# Altium project AMA4PEVB.PrjPcb (part 2 of 2)

## Sheet P06_GPIO Headers.SchDoc
size C; SheetNumber: 3; SheetTotal: 3
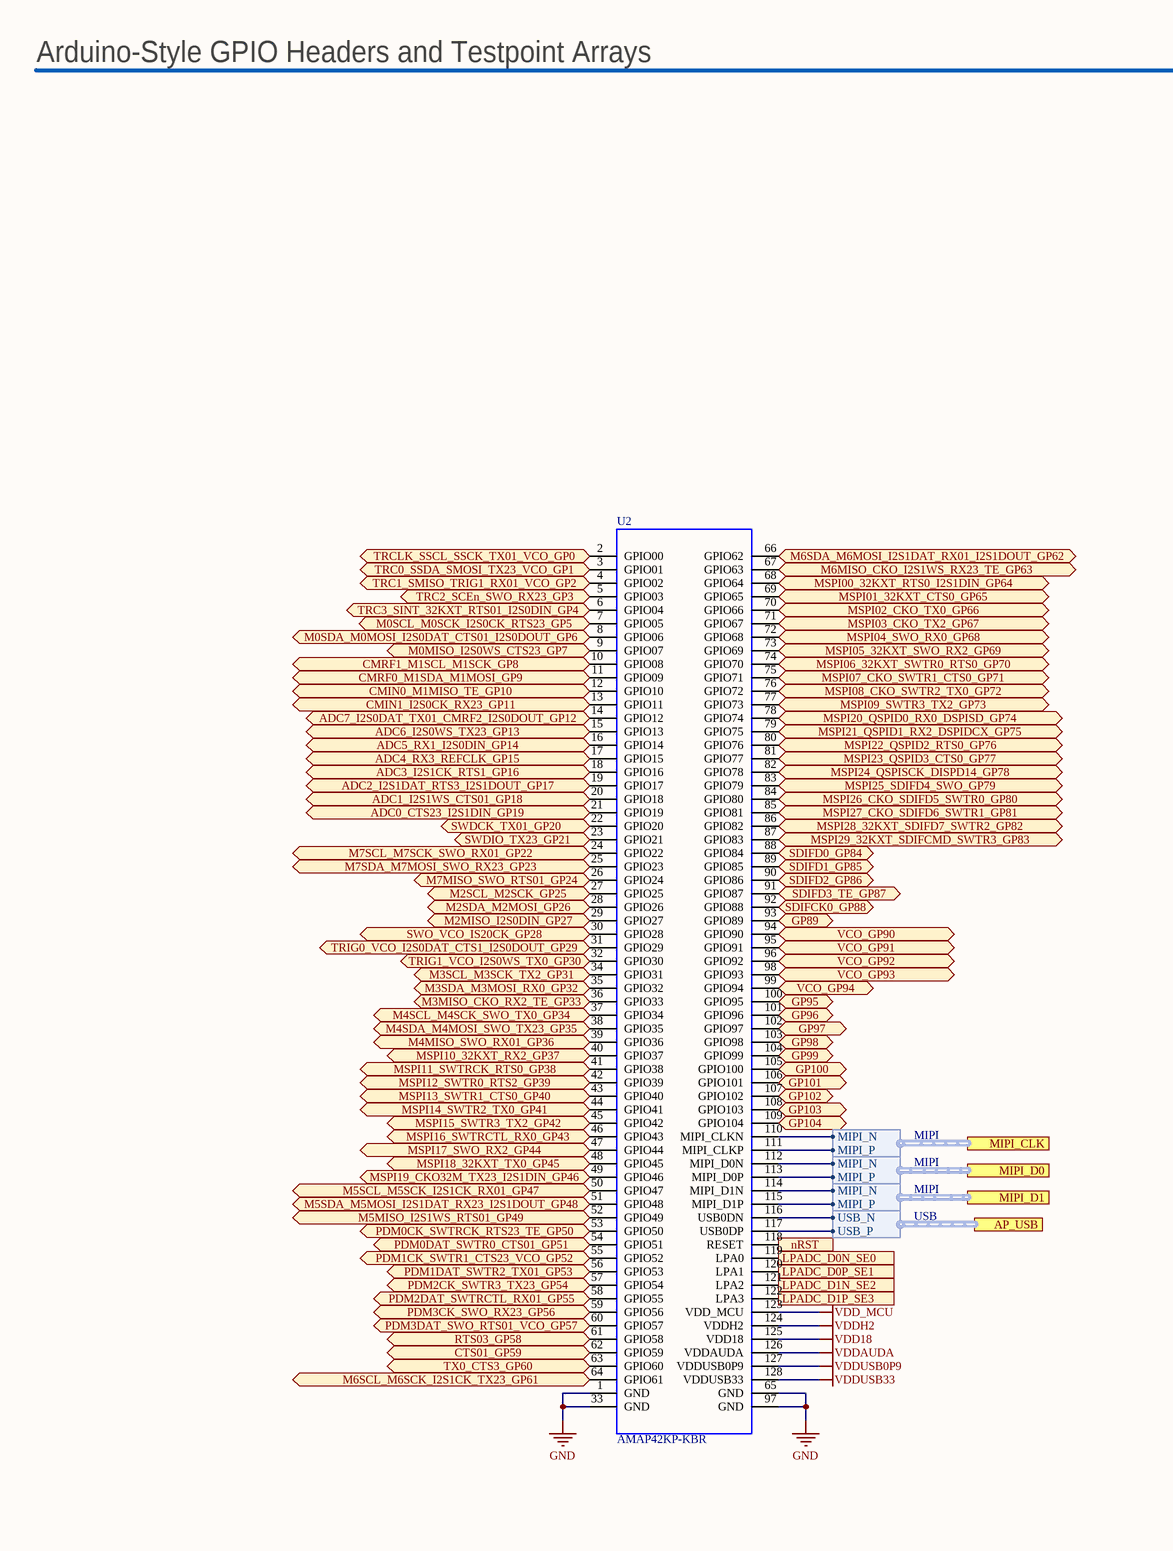
[diagram p4: P06_GPIO Headers.SchDoc, left]
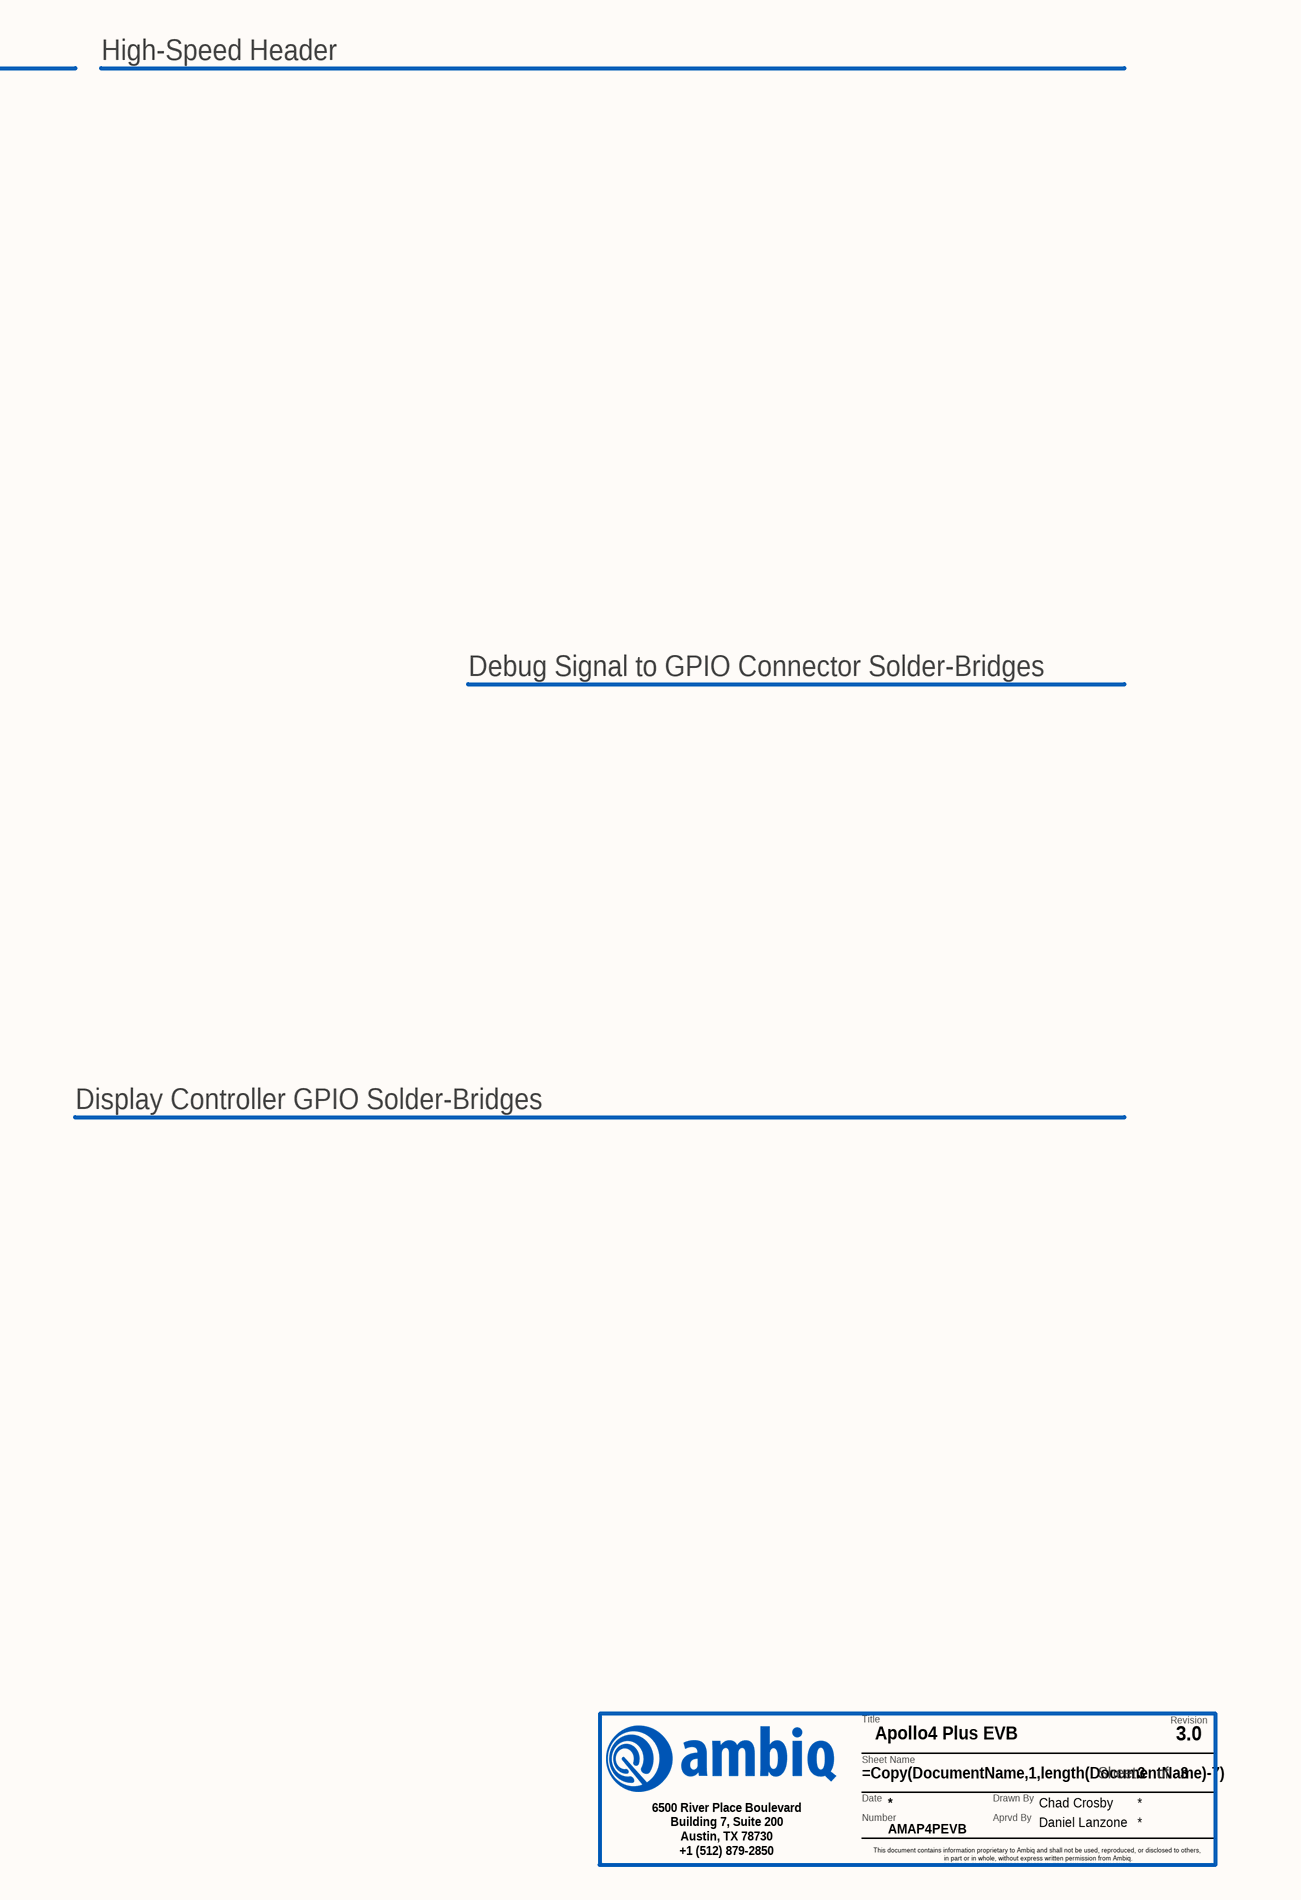
[diagram p5: P06_GPIO Headers.SchDoc, right]

### Parts
(Parts that share a designator on the sheet are numbered #1, #2 ... from top to bottom, then left to right.)
?#3  TitleBlock  (value not drawn)  (graphical)
U2  AMAP42KP-KBR  [AMAP4P]

### Ports
ADC0_CTS23_I2S1DIN_GP19 (bidir), ADC1_I2S1WS_CTS01_GP18 (bidir), ADC2_I2S1DAT_RTS3_I2S1DOUT_GP17 (bidir), ADC3_I2S1CK_RTS1_GP16 (bidir), ADC4_RX3_REFCLK_GP15 (bidir), ADC5_RX1_I2S0DIN_GP14 (bidir), ADC6_I2S0WS_TX23_GP13 (bidir), ADC7_I2S0DAT_TX01_CMRF2_I2S0DOUT_GP12 (bidir), AP_USB (harness USB), CMIN0_M1MISO_TE_GP10 (bidir), CMIN1_I2S0CK_RX23_GP11 (bidir), CMRF0_M1SDA_M1MOSI_GP9 (bidir), CMRF1_M1SCL_M1SCK_GP8 (bidir), CTS01_GP59 (bidir), GP89 (bidir), GP95 (bidir), GP96 (bidir), GP97 (bidir), GP98 (bidir), GP99 (bidir), GP100 (bidir), GP101 (bidir), GP102 (bidir), GP103 (bidir), GP104 (bidir), LPADC_D0N_SE0 (in), LPADC_D0P_SE1 (in), LPADC_D1N_SE2 (in), LPADC_D1P_SE3 (in), M0MISO_I2S0WS_CTS23_GP7 (bidir), M0SCL_M0SCK_I2S0CK_RTS23_GP5 (bidir), M0SDA_M0MOSI_I2S0DAT_CTS01_I2S0DOUT_GP6 (bidir), M2MISO_I2S0DIN_GP27 (bidir), M2SCL_M2SCK_GP25 (bidir), M2SDA_M2MOSI_GP26 (bidir), M3MISO_CKO_RX2_TE_GP33 (bidir), M3SCL_M3SCK_TX2_GP31 (bidir), M3SDA_M3MOSI_RX0_GP32 (bidir), M4MISO_SWO_RX01_GP36 (bidir), M4SCL_M4SCK_SWO_TX0_GP34 (bidir), M4SDA_M4MOSI_SWO_TX23_GP35 (bidir), M5MISO_I2S1WS_RTS01_GP49 (bidir), M5SCL_M5SCK_I2S1CK_RX01_GP47 (bidir), M5SDA_M5MOSI_I2S1DAT_RX23_I2S1DOUT_GP48 (bidir), M6MISO_CKO_I2S1WS_RX23_TE_GP63 (bidir), M6SCL_M6SCK_I2S1CK_TX23_GP61 (bidir), M6SDA_M6MOSI_I2S1DAT_RX01_I2S1DOUT_GP62 (bidir), M7MISO_SWO_RTS01_GP24 (bidir), M7SCL_M7SCK_SWO_RX01_GP22 (bidir), M7SDA_M7MOSI_SWO_RX23_GP23 (bidir), MIPI_CLK (harness MIPI), MIPI_D0 (harness MIPI), MIPI_D1 (harness MIPI), MSPI00_32KXT_RTS0_I2S1DIN_GP64 (bidir), MSPI01_32KXT_CTS0_GP65 (bidir), MSPI02_CKO_TX0_GP66 (bidir), MSPI03_CKO_TX2_GP67 (bidir), MSPI04_SWO_RX0_GP68 (bidir), MSPI05_32KXT_SWO_RX2_GP69 (bidir), MSPI06_32KXT_SWTR0_RTS0_GP70 (bidir), MSPI07_CKO_SWTR1_CTS0_GP71 (bidir), MSPI08_CKO_SWTR2_TX0_GP72 (bidir), MSPI09_SWTR3_TX2_GP73 (bidir), MSPI10_32KXT_RX2_GP37 (bidir), MSPI11_SWTRCK_RTS0_GP38 (bidir), MSPI12_SWTR0_RTS2_GP39 (bidir), MSPI13_SWTR1_CTS0_GP40 (bidir), MSPI14_SWTR2_TX0_GP41 (bidir), MSPI15_SWTR3_TX2_GP42 (bidir), MSPI16_SWTRCTL_RX0_GP43 (bidir), MSPI17_SWO_RX2_GP44 (bidir), MSPI18_32KXT_TX0_GP45 (bidir), MSPI19_CKO32M_TX23_I2S1DIN_GP46 (bidir), MSPI20_QSPID0_RX0_DSPISD_GP74 (bidir), MSPI21_QSPID1_RX2_DSPIDCX_GP75 (bidir), MSPI22_QSPID2_RTS0_GP76 (bidir), MSPI23_QSPID3_CTS0_GP77 (bidir), MSPI24_QSPISCK_DISPD14_GP78 (bidir), MSPI25_SDIFD4_SWO_GP79 (bidir), MSPI26_CKO_SDIFD5_SWTR0_GP80 (bidir), MSPI27_CKO_SDIFD6_SWTR1_GP81 (bidir), MSPI28_32KXT_SDIFD7_SWTR2_GP82 (bidir), MSPI29_32KXT_SDIFCMD_SWTR3_GP83 (bidir), nRST (in), PDM0CK_SWTRCK_RTS23_TE_GP50 (bidir), PDM0DAT_SWTR0_CTS01_GP51 (bidir), PDM1CK_SWTR1_CTS23_VCO_GP52 (bidir), PDM1DAT_SWTR2_TX01_GP53 (bidir), PDM2CK_SWTR3_TX23_GP54 (bidir), PDM2DAT_SWTRCTL_RX01_GP55 (bidir), PDM3CK_SWO_RX23_GP56 (bidir), PDM3DAT_SWO_RTS01_VCO_GP57 (bidir), RTS03_GP58 (bidir), SDIFCK0_GP88 (bidir), SDIFD0_GP84 (bidir), SDIFD1_GP85 (bidir), SDIFD2_GP86 (bidir), SDIFD3_TE_GP87 (bidir), SWDCK_TX01_GP20 (bidir), SWDIO_TX23_GP21 (bidir), SWO_VCO_IS20CK_GP28 (bidir), TRC0_SSDA_SMOSI_TX23_VCO_GP1 (bidir), TRC1_SMISO_TRIG1_RX01_VCO_GP2 (bidir), TRC2_SCEn_SWO_RX23_GP3 (bidir), TRC3_SINT_32KXT_RTS01_I2S0DIN_GP4 (bidir), TRCLK_SSCL_SSCK_TX01_VCO_GP0 (bidir), TRIG0_VCO_I2S0DAT_CTS1_I2S0DOUT_GP29 (bidir), TRIG1_VCO_I2S0WS_TX0_GP30 (bidir), TX0_CTS3_GP60 (bidir), VCO_GP90 (bidir), VCO_GP91 (bidir), VCO_GP92 (bidir), VCO_GP93 (bidir), VCO_GP94 (bidir)

### Harnesses
MIPI: MIPI_N, MIPI_P
USB: USB_N, USB_P

### Nets
GND: U2.1(GND) U2.33(GND) U2.65(GND) U2.97(GND)
VDD18: U2.125(VDD18)
VDD_MCU: U2.123(VDD_MCU)
VDDAUDA: U2.126(VDDAUDA)
VDDH2: U2.124(VDDH2)
VDDUSB0P9: U2.127(VDDUSB0P9)
VDDUSB33: U2.128(VDDUSB33)
ADC0_CTS23_I2S1DIN_GP19: U2.21(GPIO19) ; port ADC0_CTS23_I2S1DIN_GP19
ADC1_I2S1WS_CTS01_GP18: U2.20(GPIO18) ; port ADC1_I2S1WS_CTS01_GP18
ADC2_I2S1DAT_RTS3_I2S1DOUT_GP17: U2.19(GPIO17) ; port ADC2_I2S1DAT_RTS3_I2S1DOUT_GP17
ADC3_I2S1CK_RTS1_GP16: U2.18(GPIO16) ; port ADC3_I2S1CK_RTS1_GP16
ADC4_RX3_REFCLK_GP15: U2.17(GPIO15) ; port ADC4_RX3_REFCLK_GP15
ADC5_RX1_I2S0DIN_GP14: U2.16(GPIO14) ; port ADC5_RX1_I2S0DIN_GP14
ADC6_I2S0WS_TX23_GP13: U2.15(GPIO13) ; port ADC6_I2S0WS_TX23_GP13
ADC7_I2S0DAT_TX01_CMRF2_I2S0DOUT_GP12: U2.14(GPIO12) ; port ADC7_I2S0DAT_TX01_CMRF2_I2S0DOUT_GP12
AP_USB.USB_N: U2.116(USB0DN) ; port AP_USB.USB_N
AP_USB.USB_P: U2.117(USB0DP) ; port AP_USB.USB_P
CMIN0_M1MISO_TE_GP10: U2.12(GPIO10) ; port CMIN0_M1MISO_TE_GP10
CMIN1_I2S0CK_RX23_GP11: U2.13(GPIO11) ; port CMIN1_I2S0CK_RX23_GP11
CMRF0_M1SDA_M1MOSI_GP9: U2.11(GPIO09) ; port CMRF0_M1SDA_M1MOSI_GP9
CMRF1_M1SCL_M1SCK_GP8: U2.10(GPIO08) ; port CMRF1_M1SCL_M1SCK_GP8
CTS01_GP59: U2.62(GPIO59) ; port CTS01_GP59
GP89: U2.93(GPIO89) ; port GP89
GP95: U2.100(GPIO95) ; port GP95
GP96: U2.101(GPIO96) ; port GP96
GP97: U2.102(GPIO97) ; port GP97
GP98: U2.103(GPIO98) ; port GP98
GP99: U2.104(GPIO99) ; port GP99
GP100: U2.105(GPIO100) ; port GP100
GP101: U2.106(GPIO101) ; port GP101
GP102: U2.107(GPIO102) ; port GP102
GP103: U2.108(GPIO103) ; port GP103
GP104: U2.109(GPIO104) ; port GP104
LPADC_D0_N: U2.119(LPA0) ; port LPADC_D0N_SE0
LPADC_D0_P: U2.120(LPA1) ; port LPADC_D0P_SE1
LPADC_D1_N: U2.121(LPA2) ; port LPADC_D1N_SE2
LPADC_D1_P: U2.122(LPA3) ; port LPADC_D1P_SE3
M0MISO_I2S0WS_CTS23_GP7: U2.9(GPIO07) ; port M0MISO_I2S0WS_CTS23_GP7
M0SCL_M0SCK_I2S0CK_RTS23_GP5: U2.7(GPIO05) ; port M0SCL_M0SCK_I2S0CK_RTS23_GP5
M0SDA_M0MOSI_I2S0DAT_CTS01_I2S0DOUT_GP6: U2.8(GPIO06) ; port M0SDA_M0MOSI_I2S0DAT_CTS01_I2S0DOUT_GP6
M2MISO_I2S0DIN_GP27: U2.29(GPIO27) ; port M2MISO_I2S0DIN_GP27
M2SCL_M2SCK_GP25: U2.27(GPIO25) ; port M2SCL_M2SCK_GP25
M2SDA_M2MOSI_GP26: U2.28(GPIO26) ; port M2SDA_M2MOSI_GP26
M3MISO_CKO_RX2_TE_GP33: U2.36(GPIO33) ; port M3MISO_CKO_RX2_TE_GP33
M3SCL_M3SCK_TX2_GP31: U2.34(GPIO31) ; port M3SCL_M3SCK_TX2_GP31
M3SDA_M3MOSI_RX0_GP32: U2.35(GPIO32) ; port M3SDA_M3MOSI_RX0_GP32
M4MISO_SWO_RX01_GP36: U2.39(GPIO36) ; port M4MISO_SWO_RX01_GP36
M4SCL_M4SCK_SWO_TX0_GP34: U2.37(GPIO34) ; port M4SCL_M4SCK_SWO_TX0_GP34
M4SDA_M4MOSI_SWO_TX23_GP35: U2.38(GPIO35) ; port M4SDA_M4MOSI_SWO_TX23_GP35
M5MISO_I2S1WS_RTS01_GP49: U2.52(GPIO49) ; port M5MISO_I2S1WS_RTS01_GP49
M5SCL_M5SCK_I2S1CK_RX01_GP47: U2.50(GPIO47) ; port M5SCL_M5SCK_I2S1CK_RX01_GP47
M5SDA_M5MOSI_I2S1DAT_RX23_I2S1DOUT_GP48: U2.51(GPIO48) ; port M5SDA_M5MOSI_I2S1DAT_RX23_I2S1DOUT_GP48
M6MISO_CKO_I2S1WS_RX23_TE_GP63: U2.67(GPIO63) ; port M6MISO_CKO_I2S1WS_RX23_TE_GP63
M6SCL_M6SCK_I2S1CK_TX23_GP61: U2.64(GPIO61) ; port M6SCL_M6SCK_I2S1CK_TX23_GP61
M6SDA_M6MOSI_I2S1DAT_RX01_I2S1DOUT_GP62: U2.66(GPIO62) ; port M6SDA_M6MOSI_I2S1DAT_RX01_I2S1DOUT_GP62
M7MISO_SWO_RTS01_GP24: U2.26(GPIO24) ; port M7MISO_SWO_RTS01_GP24
M7SCL_M7SCK_SWO_RX01_GP22: U2.24(GPIO22) ; port M7SCL_M7SCK_SWO_RX01_GP22
M7SDA_M7MOSI_SWO_RX23_GP23: U2.25(GPIO23) ; port M7SDA_M7MOSI_SWO_RX23_GP23
MIPI_CLK.MIPI_N: U2.110(MIPI_CLKN) ; port MIPI_CLK.MIPI_N
MIPI_CLK.MIPI_P: U2.111(MIPI_CLKP) ; port MIPI_CLK.MIPI_P
MIPI_D0.MIPI_N: U2.112(MIPI_D0N) ; port MIPI_D0.MIPI_N
MIPI_D0.MIPI_P: U2.113(MIPI_D0P) ; port MIPI_D0.MIPI_P
MIPI_D1.MIPI_N: U2.114(MIPI_D1N) ; port MIPI_D1.MIPI_N
MIPI_D1.MIPI_P: U2.115(MIPI_D1P) ; port MIPI_D1.MIPI_P
MSPI00_32KXT_RTS0_I2S1DIN_GP64: U2.68(GPIO64) ; port MSPI00_32KXT_RTS0_I2S1DIN_GP64
MSPI01_32KXT_CTS0_GP65: U2.69(GPIO65) ; port MSPI01_32KXT_CTS0_GP65
MSPI02_CKO_TX0_GP66: U2.70(GPIO66) ; port MSPI02_CKO_TX0_GP66
MSPI03_CKO_TX2_GP67: U2.71(GPIO67) ; port MSPI03_CKO_TX2_GP67
MSPI04_SWO_RX0_GP68: U2.72(GPIO68) ; port MSPI04_SWO_RX0_GP68
MSPI05_32KXT_SWO_RX2_GP69: U2.73(GPIO69) ; port MSPI05_32KXT_SWO_RX2_GP69
MSPI06_32KXT_SWTR0_RTS0_GP70: U2.74(GPIO70) ; port MSPI06_32KXT_SWTR0_RTS0_GP70
MSPI07_CKO_SWTR1_CTS0_GP71: U2.75(GPIO71) ; port MSPI07_CKO_SWTR1_CTS0_GP71
MSPI08_CKO_SWTR2_TX0_GP72: U2.76(GPIO72) ; port MSPI08_CKO_SWTR2_TX0_GP72
MSPI09_SWTR3_TX2_GP73: U2.77(GPIO73) ; port MSPI09_SWTR3_TX2_GP73
MSPI10_32KXT_RX2_GP37: U2.40(GPIO37) ; port MSPI10_32KXT_RX2_GP37
MSPI11_SWTRCK_RTS0_DISPD16_GP38: U2.41(GPIO38) ; port MSPI11_SWTRCK_RTS0_GP38
MSPI11_SWTRCK_RTS0_GP38: U2.42(GPIO39) ; port MSPI12_SWTR0_RTS2_GP39
MSPI13_SWTR1_CTS0_GP40: U2.43(GPIO40) ; port MSPI13_SWTR1_CTS0_GP40
MSPI14_SWTR2_TX0_GP41: U2.44(GPIO41) ; port MSPI14_SWTR2_TX0_GP41
MSPI15_SWTR3_TX2_GP42: U2.45(GPIO42) ; port MSPI15_SWTR3_TX2_GP42
MSPI16_SWTRCTL_RX0_GP43: U2.46(GPIO43) ; port MSPI16_SWTRCTL_RX0_GP43
MSPI17_SWO_RX2_GP44: U2.47(GPIO44) ; port MSPI17_SWO_RX2_GP44
MSPI18_32KXT_TX0_GP45: U2.48(GPIO45) ; port MSPI18_32KXT_TX0_GP45
MSPI19_CKO32M_TX23_I2S1DIN_GP46: U2.49(GPIO46) ; port MSPI19_CKO32M_TX23_I2S1DIN_GP46
MSPI20_QSPID0_RX0_DSPISD_GP74: U2.78(GPIO74) ; port MSPI20_QSPID0_RX0_DSPISD_GP74
MSPI21_QSPID1_RX2_DSPIDCX_GP75: U2.79(GPIO75) ; port MSPI21_QSPID1_RX2_DSPIDCX_GP75
MSPI22_QSPID2_RTS0_GP76: U2.80(GPIO76) ; port MSPI22_QSPID2_RTS0_GP76
MSPI23_QSPID3_CTS0_GP77: U2.81(GPIO77) ; port MSPI23_QSPID3_CTS0_GP77
MSPI24_QSPISCK_DISPD14_GP78: U2.82(GPIO78) ; port MSPI24_QSPISCK_DISPD14_GP78
MSPI25_SDIFD4_SWO_GP79: U2.83(GPIO79) ; port MSPI25_SDIFD4_SWO_GP79
MSPI26_CKO_SDIFD5_SWTR0_GP80: U2.84(GPIO80) ; port MSPI26_CKO_SDIFD5_SWTR0_GP80
MSPI27_CKO_SDIFD6_SWTR1_GP81: U2.85(GPIO81) ; port MSPI27_CKO_SDIFD6_SWTR1_GP81
MSPI28_32KXT_SDIFD7_SWTR2_GP82: U2.86(GPIO82) ; port MSPI28_32KXT_SDIFD7_SWTR2_GP82
MSPI29_32KXT_SDIFCMD_SWTR3_GP83: U2.87(GPIO83) ; port MSPI29_32KXT_SDIFCMD_SWTR3_GP83
nRST: U2.118(RESET) ; port nRST
PDM0CK_SWTRCK_RTS23_TE_GP50: U2.53(GPIO50) ; port PDM0CK_SWTRCK_RTS23_TE_GP50
PDM0DAT_SWTR0_CTS01_GP51: U2.54(GPIO51) ; port PDM0DAT_SWTR0_CTS01_GP51
PDM1CK_SWTR1_CTS23_VCO_GP52: U2.55(GPIO52) ; port PDM1CK_SWTR1_CTS23_VCO_GP52
PDM1DAT_SWTR2_TX01_GP53: U2.56(GPIO53) ; port PDM1DAT_SWTR2_TX01_GP53
PDM2CK_SWTR3_TX23_GP54: U2.57(GPIO54) ; port PDM2CK_SWTR3_TX23_GP54
PDM2DAT_SWTRCTL_RX01_GP55: U2.58(GPIO55) ; port PDM2DAT_SWTRCTL_RX01_GP55
PDM3CK_SWO_RX23_GP56: U2.59(GPIO56) ; port PDM3CK_SWO_RX23_GP56
PDM3DAT_SWO_RTS01_VCO_GP57: U2.60(GPIO57) ; port PDM3DAT_SWO_RTS01_VCO_GP57
RTS03_GP58: U2.61(GPIO58) ; port RTS03_GP58
SDIFCK0_GP88: U2.92(GPIO88) ; port SDIFCK0_GP88
SDIFD0_GP84: U2.88(GPIO84) ; port SDIFD0_GP84
SDIFD1_GP85: U2.89(GPIO85) ; port SDIFD1_GP85
SDIFD2_GP86: U2.90(GPIO86) ; port SDIFD2_GP86
SDIFD3_TE_GP87: U2.91(GPIO87) ; port SDIFD3_TE_GP87
SWDCK_TX01_GP20: U2.22(GPIO20) ; port SWDCK_TX01_GP20
SWDIO_TX23_GP21: U2.23(GPIO21) ; port SWDIO_TX23_GP21
SWO_VCO_IS20CK_GP28: U2.30(GPIO28) ; port SWO_VCO_IS20CK_GP28
TRC0_SSDA_SMOSI_TX23_VCO_GP1: U2.3(GPIO01) ; port TRC0_SSDA_SMOSI_TX23_VCO_GP1
TRC1_SMISO_TRIG1_RX01_VCO_GP2: U2.4(GPIO02) ; port TRC1_SMISO_TRIG1_RX01_VCO_GP2
TRC2_SCEn_SWO_RX23_GP3: U2.5(GPIO03) ; port TRC2_SCEn_SWO_RX23_GP3
TRC3_SINT_32KXT_RTS01_I2S0DIN_GP4: U2.6(GPIO04) ; port TRC3_SINT_32KXT_RTS01_I2S0DIN_GP4
TRCLK_SSCL_SSCK_TX01_VCO_GP0: U2.2(GPIO00) ; port TRCLK_SSCL_SSCK_TX01_VCO_GP0
TRIG0_VCO_I2S0DAT_CTS1_I2S0DOUT_GP29: U2.31(GPIO29) ; port TRIG0_VCO_I2S0DAT_CTS1_I2S0DOUT_GP29
TRIG1_VCO_I2S0WS_TX0_GP30: U2.32(GPIO30) ; port TRIG1_VCO_I2S0WS_TX0_GP30
TX0_CTS3_GP60: U2.63(GPIO60) ; port TX0_CTS3_GP60
VCO_GP90: U2.94(GPIO90) ; port VCO_GP90
VCO_GP91: U2.95(GPIO91) ; port VCO_GP91
VCO_GP92: U2.96(GPIO92) ; port VCO_GP92
VCO_GP93: U2.98(GPIO93) ; port VCO_GP93
VCO_GP94: U2.99(GPIO94) ; port VCO_GP94

### Notes on the sheet
- Arduino-Style GPIO Headers and Testpoint Arrays
- High-Speed Header
- Debug Signal to GPIO Connector Solder-Bridges
- Display Controller GPIO Solder-Bridges
- (in symbol TitleBlock) Revision; Title; Sheet Name; Sheet; of; Date; Drawn By; Number; Aprvd By; 6500 River Place Boulevard / Building 7, Suite 200 / Austin, TX 78730 / +1 (512) 879-2850; This document contains information proprietary to Ambiq and shall not be used, reproduced, or disclosed to others, / in part or in whole, without express written permission from Ambiq.

### Library data of the parts
?#3 = TitleBlock: Title block for Ambiq Schematics. Please have the following parameters entered in Project>Project Options>Parameters: / TBTitle / TBDocumentNumber / TBRevision / TBDrawnBy / TBApprovedBy; AMBIQ PN: TitleBlock
U2 = APOLLO4P_OUT: None; AMBIQ PN: APOLLO4P; Category: Microcontrollers

## Nets that join several sheets
GND: P02_Apollo 4 Plus (29 pins), P06_GPIO Headers (U2.1 U2.33 U2.65 U2.97)
VDD18: P02_Apollo 4 Plus (C17.1 U1.M12), P06_GPIO Headers (U2.125)
VDD_MCU: P02_Apollo 4 Plus (9 pins), P06_GPIO Headers (U2.123)
VDDAUDA: P02_Apollo 4 Plus (C18.1 U1.B12), P06_GPIO Headers (U2.126)
VDDH2: P02_Apollo 4 Plus (C15.1 U1.M9), P06_GPIO Headers (U2.124)
VDDUSB0P9: P02_Apollo 4 Plus (C21.1 U1.L7), P06_GPIO Headers (U2.127)
VDDUSB33: P02_Apollo 4 Plus (C22.1 U1.K7), P06_GPIO Headers (U2.128)
ADC0_CTS23_I2S1DIN_GP19: P02_Apollo 4 Plus (U1.C3), P06_GPIO Headers (U2.21)
ADC1_I2S1WS_CTS01_GP18: P02_Apollo 4 Plus (U1.D3), P06_GPIO Headers (U2.20)
ADC2_I2S1DAT_RTS3_I2S1DOUT_GP17: P02_Apollo 4 Plus (U1.D4), P06_GPIO Headers (U2.19)
ADC3_I2S1CK_RTS1_GP16: P02_Apollo 4 Plus (U1.D7), P06_GPIO Headers (U2.18)
ADC4_RX3_REFCLK_GP15: P02_Apollo 4 Plus (U1.E5), P06_GPIO Headers (U2.17)
ADC5_RX1_I2S0DIN_GP14: P02_Apollo 4 Plus (U1.D6), P06_GPIO Headers (U2.16)
ADC6_I2S0WS_TX23_GP13: P02_Apollo 4 Plus (U1.D5), P06_GPIO Headers (U2.15)
ADC7_I2S0DAT_TX01_CMRF2_I2S0DOUT_GP12: P02_Apollo 4 Plus (U1.C4), P06_GPIO Headers (U2.14)
AP_USB.USB_N: P02_Apollo 4 Plus (U1.M8), P06_GPIO Headers (U2.116)
AP_USB.USB_P: P02_Apollo 4 Plus (U1.M7), P06_GPIO Headers (U2.117)
CMIN0_M1MISO_TE_GP10: P02_Apollo 4 Plus (U1.E6), P06_GPIO Headers (U2.12)
CMIN1_I2S0CK_RX23_GP11: P02_Apollo 4 Plus (U1.E4), P06_GPIO Headers (U2.13)
CMRF0_M1SDA_M1MOSI_GP9: P02_Apollo 4 Plus (U1.E7), P06_GPIO Headers (U2.11)
CMRF1_M1SCL_M1SCK_GP8: P02_Apollo 4 Plus (U1.E8), P06_GPIO Headers (U2.10)
CTS01_GP59: P02_Apollo 4 Plus (U1.J8), P06_GPIO Headers (U2.62)
GP89: P02_Apollo 4 Plus (U1.F10), P06_GPIO Headers (U2.93)
GP95: P02_Apollo 4 Plus (U1.J5), P06_GPIO Headers (U2.100)
GP96: P02_Apollo 4 Plus (U1.H5), P06_GPIO Headers (U2.101)
GP97: P02_Apollo 4 Plus (U1.G5), P06_GPIO Headers (U2.102)
GP98: P02_Apollo 4 Plus (U1.H4), P06_GPIO Headers (U2.103)
GP99: P02_Apollo 4 Plus (U1.J4), P06_GPIO Headers (U2.104)
GP100: P02_Apollo 4 Plus (U1.G3), P06_GPIO Headers (U2.105)
GP101: P02_Apollo 4 Plus (U1.H3), P06_GPIO Headers (U2.106)
GP102: P02_Apollo 4 Plus (U1.G2), P06_GPIO Headers (U2.107)
GP103: P02_Apollo 4 Plus (U1.H2), P06_GPIO Headers (U2.108)
GP104: P02_Apollo 4 Plus (U1.J2), P06_GPIO Headers (U2.109)
LPADC_D0_N: P02_Apollo 4 Plus (U1.A11), P06_GPIO Headers (U2.119)
LPADC_D0_P: P02_Apollo 4 Plus (U1.A12), P06_GPIO Headers (U2.120)
LPADC_D1_N: P02_Apollo 4 Plus (U1.C12), P06_GPIO Headers (U2.121)
LPADC_D1_P: P02_Apollo 4 Plus (U1.D12), P06_GPIO Headers (U2.122)
M0MISO_I2S0WS_CTS23_GP7: P02_Apollo 4 Plus (U1.M6), P06_GPIO Headers (U2.9)
M0SCL_M0SCK_I2S0CK_RTS23_GP5: P02_Apollo 4 Plus (U1.K6), P06_GPIO Headers (U2.7)
M0SDA_M0MOSI_I2S0DAT_CTS01_I2S0DOUT_GP6: P02_Apollo 4 Plus (U1.L6), P06_GPIO Headers (U2.8)
M2MISO_I2S0DIN_GP27: P02_Apollo 4 Plus (U1.M4), P06_GPIO Headers (U2.29)
M2SCL_M2SCK_GP25: P02_Apollo 4 Plus (U1.K4), P06_GPIO Headers (U2.27)
M2SDA_M2MOSI_GP26: P02_Apollo 4 Plus (U1.L4), P06_GPIO Headers (U2.28)
M3MISO_CKO_RX2_TE_GP33: P02_Apollo 4 Plus (U1.K1), P06_GPIO Headers (U2.36)
M3SCL_M3SCK_TX2_GP31: P02_Apollo 4 Plus (U1.M1), P06_GPIO Headers (U2.34)
M3SDA_M3MOSI_RX0_GP32: P02_Apollo 4 Plus (U1.L1), P06_GPIO Headers (U2.35)
M4MISO_SWO_RX01_GP36: P02_Apollo 4 Plus (U1.G1), P06_GPIO Headers (U2.39)
M4SCL_M4SCK_SWO_TX0_GP34: P02_Apollo 4 Plus (U1.J1), P06_GPIO Headers (U2.37)
M4SDA_M4MOSI_SWO_TX23_GP35: P02_Apollo 4 Plus (U1.H1), P06_GPIO Headers (U2.38)
M5MISO_I2S1WS_RTS01_GP49: P02_Apollo 4 Plus (U1.D1), P06_GPIO Headers (U2.52)
M5SCL_M5SCK_I2S1CK_RX01_GP47: P02_Apollo 4 Plus (U1.F1), P06_GPIO Headers (U2.50)
M5SDA_M5MOSI_I2S1DAT_RX23_I2S1DOUT_GP48: P02_Apollo 4 Plus (U1.E1), P06_GPIO Headers (U2.51)
M6MISO_CKO_I2S1WS_RX23_TE_GP63: P02_Apollo 4 Plus (U1.M5), P06_GPIO Headers (U2.67)
M6SCL_M6SCK_I2S1CK_TX23_GP61: P02_Apollo 4 Plus (U1.K5), P06_GPIO Headers (U2.64)
M6SDA_M6MOSI_I2S1DAT_RX01_I2S1DOUT_GP62: P02_Apollo 4 Plus (U1.L5), P06_GPIO Headers (U2.66)
M7MISO_SWO_RTS01_GP24: P02_Apollo 4 Plus (U1.E2), P06_GPIO Headers (U2.26)
M7SCL_M7SCK_SWO_RX01_GP22: P02_Apollo 4 Plus (U1.F3), P06_GPIO Headers (U2.24)
M7SDA_M7MOSI_SWO_RX23_GP23: P02_Apollo 4 Plus (U1.F2), P06_GPIO Headers (U2.25)
MIPI_CLK.MIPI_N: P02_Apollo 4 Plus (U1.G13), P06_GPIO Headers (U2.110)
MIPI_CLK.MIPI_P: P02_Apollo 4 Plus (U1.H13), P06_GPIO Headers (U2.111)
MIPI_D0.MIPI_N: P02_Apollo 4 Plus (U1.L13), P06_GPIO Headers (U2.112)
MIPI_D0.MIPI_P: P02_Apollo 4 Plus (U1.M13), P06_GPIO Headers (U2.113)
MIPI_D1.MIPI_N: P02_Apollo 4 Plus (U1.J13), P06_GPIO Headers (U2.114)
MIPI_D1.MIPI_P: P02_Apollo 4 Plus (U1.K13), P06_GPIO Headers (U2.115)
MSPI00_32KXT_RTS0_I2S1DIN_GP64: P02_Apollo 4 Plus (U1.B6), P06_GPIO Headers (U2.68)
MSPI01_32KXT_CTS0_GP65: P02_Apollo 4 Plus (U1.A7), P06_GPIO Headers (U2.69)
MSPI02_CKO_TX0_GP66: P02_Apollo 4 Plus (U1.A8), P06_GPIO Headers (U2.70)
MSPI03_CKO_TX2_GP67: P02_Apollo 4 Plus (U1.C6), P06_GPIO Headers (U2.71)
MSPI04_SWO_RX0_GP68: P02_Apollo 4 Plus (U1.B7), P06_GPIO Headers (U2.72)
MSPI05_32KXT_SWO_RX2_GP69: P02_Apollo 4 Plus (U1.B8), P06_GPIO Headers (U2.73)
MSPI06_32KXT_SWTR0_RTS0_GP70: P02_Apollo 4 Plus (U1.C5), P06_GPIO Headers (U2.74)
MSPI07_CKO_SWTR1_CTS0_GP71: P02_Apollo 4 Plus (U1.C7), P06_GPIO Headers (U2.75)
MSPI08_CKO_SWTR2_TX0_GP72: P02_Apollo 4 Plus (U1.C8), P06_GPIO Headers (U2.76)
MSPI09_SWTR3_TX2_GP73: P02_Apollo 4 Plus (U1.D8), P06_GPIO Headers (U2.77)
MSPI10_32KXT_RX2_GP37: P02_Apollo 4 Plus (U1.H11), P06_GPIO Headers (U2.40)
MSPI11_SWTRCK_RTS0_DISPD16_GP38: P02_Apollo 4 Plus (U1.F12), P06_GPIO Headers (U2.41)
MSPI11_SWTRCK_RTS0_GP38: P02_Apollo 4 Plus (U1.G11), P06_GPIO Headers (U2.42)
MSPI13_SWTR1_CTS0_GP40: P02_Apollo 4 Plus (U1.F13), P06_GPIO Headers (U2.43)
MSPI14_SWTR2_TX0_GP41: P02_Apollo 4 Plus (U1.F11), P06_GPIO Headers (U2.44)
MSPI15_SWTR3_TX2_GP42: P02_Apollo 4 Plus (U1.H12), P06_GPIO Headers (U2.45)
MSPI16_SWTRCTL_RX0_GP43: P02_Apollo 4 Plus (U1.J11), P06_GPIO Headers (U2.46)
MSPI17_SWO_RX2_GP44: P02_Apollo 4 Plus (U1.G12), P06_GPIO Headers (U2.47)
MSPI18_32KXT_TX0_GP45: P02_Apollo 4 Plus (U1.D11), P06_GPIO Headers (U2.48)
MSPI19_CKO32M_TX23_I2S1DIN_GP46: P02_Apollo 4 Plus (U1.E11), P06_GPIO Headers (U2.49)
MSPI20_QSPID0_RX0_DSPISD_GP74: P02_Apollo 4 Plus (U1.J12), P06_GPIO Headers (U2.78)
MSPI21_QSPID1_RX2_DSPIDCX_GP75: P02_Apollo 4 Plus (U1.K12), P06_GPIO Headers (U2.79)
MSPI22_QSPID2_RTS0_GP76: P02_Apollo 4 Plus (U1.L12), P06_GPIO Headers (U2.80)
MSPI23_QSPID3_CTS0_GP77: P02_Apollo 4 Plus (U1.K11), P06_GPIO Headers (U2.81)
MSPI24_QSPISCK_DISPD14_GP78: P02_Apollo 4 Plus (U1.L11), P06_GPIO Headers (U2.82)
MSPI25_SDIFD4_SWO_GP79: P02_Apollo 4 Plus (U1.M11), P06_GPIO Headers (U2.83)
MSPI26_CKO_SDIFD5_SWTR0_GP80: P02_Apollo 4 Plus (U1.K10), P06_GPIO Headers (U2.84)
MSPI27_CKO_SDIFD6_SWTR1_GP81: P02_Apollo 4 Plus (U1.L10), P06_GPIO Headers (U2.85)
MSPI28_32KXT_SDIFD7_SWTR2_GP82: P02_Apollo 4 Plus (U1.L9), P06_GPIO Headers (U2.86)
MSPI29_32KXT_SDIFCMD_SWTR3_GP83: P02_Apollo 4 Plus (U1.K9), P06_GPIO Headers (U2.87)
nRST: P02_Apollo 4 Plus (C9.1 U1.A6), P06_GPIO Headers (U2.118)
PDM0CK_SWTRCK_RTS23_TE_GP50: P02_Apollo 4 Plus (U1.A10), P06_GPIO Headers (U2.53)
PDM0DAT_SWTR0_CTS01_GP51: P02_Apollo 4 Plus (U1.A9), P06_GPIO Headers (U2.54)
PDM1CK_SWTR1_CTS23_VCO_GP52: P02_Apollo 4 Plus (U1.B10), P06_GPIO Headers (U2.55)
PDM1DAT_SWTR2_TX01_GP53: P02_Apollo 4 Plus (U1.B9), P06_GPIO Headers (U2.56)
PDM2CK_SWTR3_TX23_GP54: P02_Apollo 4 Plus (U1.C10), P06_GPIO Headers (U2.57)
PDM2DAT_SWTRCTL_RX01_GP55: P02_Apollo 4 Plus (U1.C9), P06_GPIO Headers (U2.58)
PDM3CK_SWO_RX23_GP56: P02_Apollo 4 Plus (U1.D10), P06_GPIO Headers (U2.59)
PDM3DAT_SWO_RTS01_VCO_GP57: P02_Apollo 4 Plus (U1.D9), P06_GPIO Headers (U2.60)
RTS03_GP58: P02_Apollo 4 Plus (U1.J7), P06_GPIO Headers (U2.61)
SDIFCK0_GP88: P02_Apollo 4 Plus (U1.F9), P06_GPIO Headers (U2.92)
SDIFD0_GP84: P02_Apollo 4 Plus (U1.J9), P06_GPIO Headers (U2.88)
SDIFD1_GP85: P02_Apollo 4 Plus (U1.H9), P06_GPIO Headers (U2.89)
SDIFD2_GP86: P02_Apollo 4 Plus (U1.G10), P06_GPIO Headers (U2.90)
SDIFD3_TE_GP87: P02_Apollo 4 Plus (U1.G9), P06_GPIO Headers (U2.91)
SWDCK_TX01_GP20: P02_Apollo 4 Plus (U1.K3), P06_GPIO Headers (U2.22)
SWDIO_TX23_GP21: P02_Apollo 4 Plus (U1.J3), P06_GPIO Headers (U2.23)
SWO_VCO_IS20CK_GP28: P02_Apollo 4 Plus (U1.E3), P06_GPIO Headers (U2.30)
TRC0_SSDA_SMOSI_TX23_VCO_GP1: P02_Apollo 4 Plus (U1.L2), P06_GPIO Headers (U2.3)
TRC1_SMISO_TRIG1_RX01_VCO_GP2: P02_Apollo 4 Plus (U1.M2), P06_GPIO Headers (U2.4)
TRC2_SCEn_SWO_RX23_GP3: P02_Apollo 4 Plus (U1.L3), P06_GPIO Headers (U2.5)
TRC3_SINT_32KXT_RTS01_I2S0DIN_GP4: P02_Apollo 4 Plus (U1.M3), P06_GPIO Headers (U2.6)
TRCLK_SSCL_SSCK_TX01_VCO_GP0: P02_Apollo 4 Plus (U1.K2), P06_GPIO Headers (U2.2)
TRIG0_VCO_I2S0DAT_CTS1_I2S0DOUT_GP29: P02_Apollo 4 Plus (U1.F4), P06_GPIO Headers (U2.31)
TRIG1_VCO_I2S0WS_TX0_GP30: P02_Apollo 4 Plus (U1.G4), P06_GPIO Headers (U2.32)
TX0_CTS3_GP60: P02_Apollo 4 Plus (U1.K8), P06_GPIO Headers (U2.63)
VCO_GP90: P02_Apollo 4 Plus (U1.C11), P06_GPIO Headers (U2.94)
VCO_GP91: P02_Apollo 4 Plus (U1.E10), P06_GPIO Headers (U2.95)
VCO_GP92: P02_Apollo 4 Plus (U1.E9), P06_GPIO Headers (U2.96)
VCO_GP93: P02_Apollo 4 Plus (U1.H10), P06_GPIO Headers (U2.98)
VCO_GP94: P02_Apollo 4 Plus (U1.J6), P06_GPIO Headers (U2.99)

## Assembly variants
AMAP4PEVB: not fitted C6 C7 C8 R5 R6 R18 R32 R33 R38 R38 R48 R51 R52 R53 R56 SS1 SS2 SS3 SS4 TP2 TP3 TP4; alternate parts U7 -> NCP380LMU05AATBG